# Altium schematic sheet 01_mcu.SchDoc
size A4; SheetNumber: 2; SheetTotal: 4
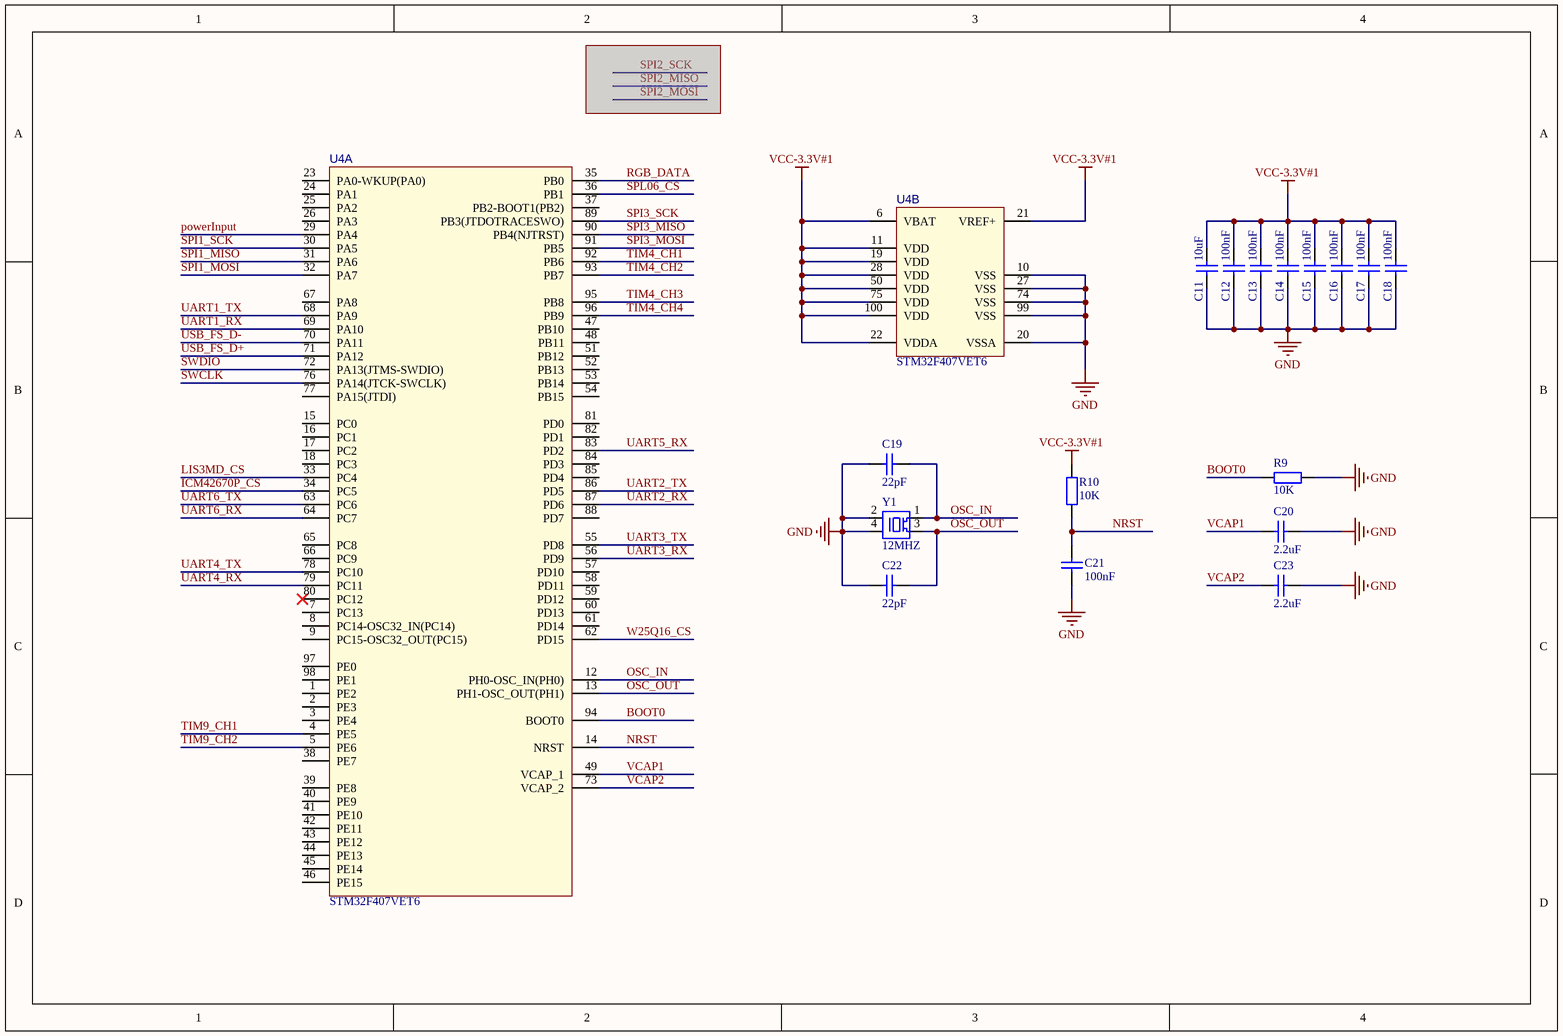
[diagram p0: 01_mcu.SchDoc]

## Parts
C11  10uF  [0603-C]
C12  100nF  [0603-C]
C13  100nF  [0603-C]
C14  100nF  [0603-C]
C15  100nF  [0603-C]
C16  100nF  [0603-C]
C17  100nF  [0603-C]
C18  100nF  [0603-C]
C19  22pF  [0603-C]
C20  2.2uF  [0603-C]
C21  100nF  [0603-C]
C22  22pF  [0603-C]
C23  2.2uF  [0603-C]
R9  10K  [0603-R]
R10  10K  [0603-R]
U4  STM32F407VET6  [STM32F407VET6]  (parts A,B of 2)
Y1  12MHZ  [3225]

## Nets
GND: C11.1 C12.1 C13.1 C14.1 C15.1 C16.1 C17.1 C18.1 C19.1 C20.2 C21.1 C22.1 C23.2 R9.1 U4.10(VSS) U4.20(VSSA) U4.27(VSS) U4.74(VSS) U4.99(VSS) Y1.2(GND) Y1.4(GND)
VCC-3.3V#1: C11.2 C12.2 C13.2 C14.2 C15.2 C16.2 C17.2 C18.2 R10.2 U4.6(VBAT) U4.11(VDD) U4.19(VDD) U4.21(VREF+) U4.22(VDDA) U4.28(VDD) U4.50(VDD) U4.75(VDD) U4.100(VDD)
BOOT0: R9.2 U4.94(BOOT0)
ICM42670P_CS: U4.34(PC5)
LIS3MD_CS: U4.33(PC4)
NRST: C21.2 R10.1 U4.14(NRST)
OSC_IN: C19.2 U4.12(PH0-OSC_IN(PH0)) Y1.1(XTAL1)
OSC_OUT: C22.2 U4.13(PH1-OSC_OUT(PH1)) Y1.3(XTAL3)
powerInput: U4.29(PA4)
RGB_DATA: U4.35(PB0)
SPI1_MISO: U4.31(PA6)
SPI1_MOSI: U4.32(PA7)
SPI1_SCK: U4.30(PA5)
SPI3_MISO: U4.90(PB4(NJTRST))
SPI3_MOSI: U4.91(PB5)
SPI3_SCK: U4.89(PB3(JTDOTRACESWO))
SPL06_CS: U4.36(PB1)
SWCLK: U4.76(PA14(JTCK-SWCLK))
SWDIO: U4.72(PA13(JTMS-SWDIO))
TIM4_CH1: U4.92(PB6)
TIM4_CH2: U4.93(PB7)
TIM4_CH3: U4.95(PB8)
TIM4_CH4: U4.96(PB9)
TIM9_CH1: U4.4(PE5)
TIM9_CH2: U4.5(PE6)
UART1_RX: U4.69(PA10)
UART1_TX: U4.68(PA9)
UART2_RX: U4.87(PD6)
UART2_TX: U4.86(PD5)
UART3_RX: U4.56(PD9)
UART3_TX: U4.55(PD8)
UART4_RX: U4.79(PC11)
UART4_TX: U4.78(PC10)
UART5_RX: U4.83(PD2)
UART6_RX: U4.64(PC7)
UART6_TX: U4.63(PC6)
USB_FS_D+: U4.71(PA12)
USB_FS_D-: U4.70(PA11)
VCAP1: C20.1 U4.49(VCAP_1)
VCAP2: C23.1 U4.73(VCAP_2)
W25Q16_CS: U4.62(PD15)

Not connected (* = marked no-connect by the designer): U4 1(PE2) 2(PE3) 3(PE4) 7(PC13) 8(PC14-OSC32_IN(PC14)) 9(PC15-OSC32_OUT(PC15)) 15(PC0) 16(PC1) 17(PC2) 18(PC3) 23(PA0-WKUP(PA0)) 24(PA1) 25(PA2) 26(PA3) 37(PB2-BOOT1(PB2)) 38(PE7) 39(PE8) 40(PE9) 41(PE10) 42(PE11) 43(PE12) 44(PE13) 45(PE14) 46(PE15) 47(PB10) 48(PB11) 51(PB12) 52(PB13) 53(PB14) 54(PB15) 57(PD10) 58(PD11) 59(PD12) 60(PD13) 61(PD14) 65(PC8) 66(PC9) 67(PA8) 77(PA15(JTDI)) 80(PC12)* 81(PD0) 82(PD1) 84(PD3) 85(PD4) 88(PD7) 97(PE0) 98(PE1)

## Library data of the parts
C11-C23 = C: 贴片电容; BOM名称: 无极性贴片电容; 联系卖家，免费查找封装: 唯一出售店铺网址https://shop463601444.taobao.com
R9 R10 = R: 贴片电阻; 联系卖家，免费查找封装: 唯一出售店铺网址https://shop463601444.taobao.com; BOM名称: 贴片电阻
U4 = STM32F407VET6: Manufacturer: ST(意法半导体); Add into BOM: yes; CPU Core: ARM Cortex-M4; CPU Maximum Speed: 168MHz; Operating Voltage Range: 1.8V~3.6V; Program Storage Size: 512KB; Program Memory Type: FLASH; RAM Size: 192KB; GPIO Ports Number: 82; ADC (Bit): 12bit; Universal Serial Bus: 有; Peripheral/Function: DMA；LCD/LED驱动；PWM; tags: STM32; Name: STM32F407VET6; Symbol: STM32F407VET6; Device: STM32F407VET6; LCSC Part Name: STM32F407VET6; Supplier Part: C28730; Manufacturer Part: STM32F407VET6; Supplier Footprint: LQFP-100(14x14); JLCPCB Part Class: Extended Part; Datasheet: https://atta.szlcsc.com/upload/public/pdf/source/20140801/1457707197138.pdf; Supplier: LCSC; Convert to PCB: yes; EEPROM: -; DAC (Bit): 12bit; PWM (Bit): -; Internal Comparator: -; communication protocol: -; Watchdog: 有; Real-Time Clock: -; Infrared Data Association: 有; Low-Voltage Detect: 有; CCP Capture/Compare: -; LCD Module: 有; Secure Digital Input and Output: -; Direct Memory Access: 有; Internal Oscillator: 有; Operating Temperature Range: -40℃~+85℃; image: http://image.lceda.cn/szlcsc/C28730.jpg
Y1 = Y: 无源晶振